# EAGLE schematic SCHEMAT_PŁYTY_GŁÓWNEJ (EAGLE 9.2.0)
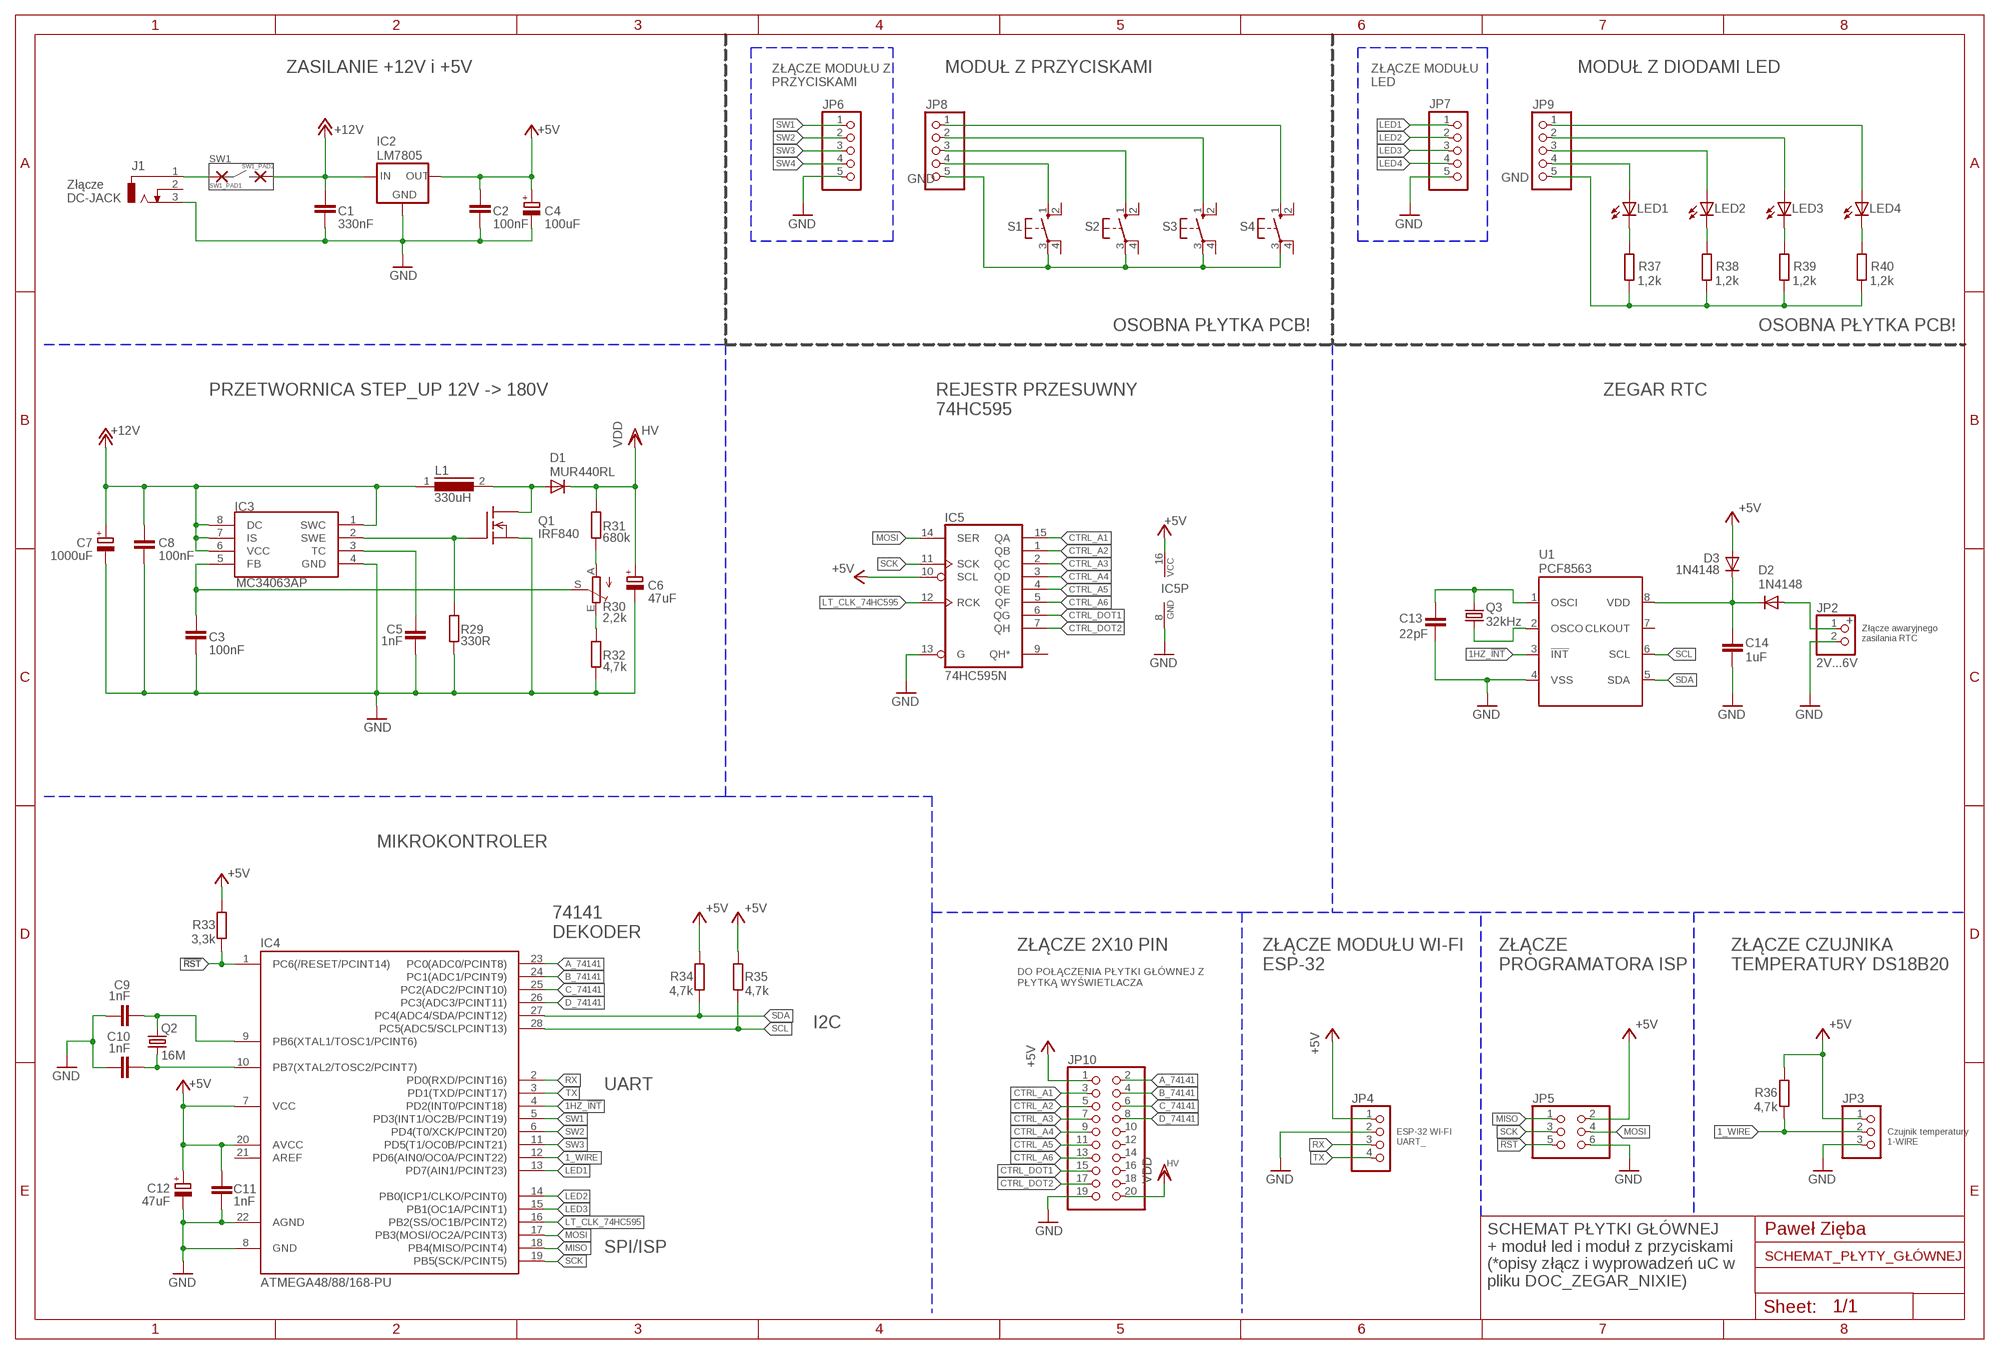
[diagram p0: schematic, sheet 1]

## Parts
C1  330nF  C-EU050-045X075  [C050-045X075]
C2  100nF  C-EU050-045X075  [C050-045X075]
C3  100nF  C-EU050-045X075  [C050-045X075]
C4  100uF  CPOL-EUE5-13  [E5-13]
C5  1nF  C-EU050-045X075  [C050-045X075]
C6  47uF  CPOL-EUE5-13  [E5-13]
C7  1000uF  CPOL-EUE5-13  [E5-13]
C8  100nF  C-EU050-045X075  [C050-045X075]
C9  1nF  C-EU050-045X075  [C050-045X075]
C10  1nF  C-EU050-045X075  [C050-045X075]
C11  1nF  C-EU050-045X075  [C050-045X075]
C12  47uF  CPOL-EUE5-13  [E5-13]
C13  22pF  C-EU050-045X075  [C050-045X075]
C14  1uF  C-EU050-045X075  [C050-045X075]
D1  MUR440RL  [C2673]
D2  1N4148  1N4148DO35-10  [DO35-10]
D3  1N4148  1N4148DO35-10  [DO35-10]
IC2  LM7805  78XXS  [78XXS]
IC3  MC34063AP  [DIL08]
IC4  ATMEGA48/88/168-PU  [DIL28-3]
IC5  74HC595N  [DIL16]
J1  DCJ0303  [DCJ0303]
JP2  2V...6V  PINHD-1X2  [1X02]
JP3  PINHD-1X3  [1X03]
JP4  PINHD-1X4  [1X04]
JP5  PINHD-2X3  [2X03]
JP6  PINHD-1X5  [1X05]
JP7  PINHD-1X5  [1X05]
JP8  PINHD-1X5  [1X05]
JP9  PINHD-1X5  [1X05]
JP10  PINHD-2X10  [2X10]
L1  330uH  SFT830S  [SFT830S]
LED1  LED5MM  [LED5MM]
LED2  LED5MM  [LED5MM]
LED3  LED5MM  [LED5MM]
LED4  LED5MM  [LED5MM]
Q1  IRF840  [TO220]
Q2  16M  CRYSTALHC49U-V  [HC49U-V]
Q3  32kHz  CRYSTALTC26H  [TC26H]
R29  330R  R-EU7  [204/7]
R30  2,2k  TRIM_EU-CA6V  [CA6V]
R31  680k  R-EU7  [204/7]
R32  4,7k  R-EU7  [204/7]
R33  3,3k  R-EU7  [204/7]
R34  4,7k  R-EU7  [204/7]
R35  4,7k  R-EU7  [204/7]
R36  4,7k  R-EU7  [204/7]
R37  1,2k  R-EU7  [204/7]
R38  1,2k  R-EU7  [204/7]
R39  1,2k  R-EU7  [204/7]
R40  1,2k  R-EU7  [204/7]
S1  10-XX  [B3F-10XX]
S2  10-XX  [B3F-10XX]
S3  10-XX  [B3F-10XX]
S4  10-XX  [B3F-10XX]
SW1_PAD1  3,81/1,4  [3,81/1,4]
SW1_PAD2  3,81/1,4  [3,81/1,4]
U1  PCF8563  [DIL08]

## Nets
1_WIRE: IC4.12(PD6(AIN0/OC0A/PCINT22)) JP3.2 R36.P$1
1HZ_!INT: IC4.4(PD2(INT0/PCINT18)) U1.3(!INT)
!RST: IC4.1(PC6(/RESET/PCINT14)) JP5.5 R33.P$1
+5V: C2.1 C4.+ C11.2 C12.+ D3.A IC2.OUT IC4.7(VCC) IC4.20(AVCC) IC5.10(SCL) IC5.16(VCC) JP3.1 JP4.1 JP5.2 JP10.1 R33.P$2 R34.P$2 R35.P$2 R36.P$2
+12V: C1.1 C7.+ C8.1 IC2.IN IC3.1(SWC) IC3.6(VCC) IC3.7(IS) IC3.8(DC) L1.1 SW1_PAD2.1(P)
A_74141: IC4.23(PC0(ADC0/PCINT8)) JP10.2
B_74141: IC4.24(PC1(ADC1/PCINT9)) JP10.4
C_74141: IC4.25(PC2(ADC2/PCINT10)) JP10.6
CTRL_A1: IC5.15(QA) JP10.3
CTRL_A2: IC5.1(QB) JP10.5
CTRL_A3: IC5.2(QC) JP10.7
CTRL_A4: IC5.3(QD) JP10.9
CTRL_A5: IC5.4(QE) JP10.11
CTRL_A6: IC5.5(QF) JP10.13
CTRL_DOT1: IC5.6(QG) JP10.15
CTRL_DOT2: IC5.7(QH) JP10.17
D_74141: IC4.26(PC3(ADC3/PCINT11)) JP10.8
GND: C1.2 C2.2 C3.2 C4.- C5.2 C6.- C7.- C8.2 C9.1 C10.1 C11.1 C12.- C13.2 C14.2 IC2.GND IC3.4(GND) IC4.8(GND) IC4.22(AGND) IC5.8(GND) IC5.13(G) J1.3 JP2.2 JP3.3 JP4.2 JP5.6 JP6.5 JP7.5 JP10.19 Q1.3(S) R29.P$1 R32.P$1 U1.4(VSS)
HV: C6.+ D1.C JP10.20 R31.P$2 ; supply symbol labelled VDD
LED1: IC4.13(PD7(AIN1/PCINT23)) JP7.1
LED2: IC4.14(PB0(ICP1/CLKO/PCINT0)) JP7.2
LED3: IC4.15(PB1(OC1A/PCINT1)) JP7.3
LED4: JP7.4
LT_CLK_74HC595: IC4.16(PB2(SS/OC1B/PCINT2)) IC5.12(RCK)
MISO: IC4.18(PB4(MISO/PCINT4)) JP5.1
MOSI: IC4.17(PB3(MOSI/OC2A/PCINT3)) IC5.14(SER) JP5.4
N$21: J1.1 SW1_PAD1.1(P)
N$22: C5.1 IC3.3(TC)
N$23: R30.A R31.P$1
N$24: C9.2 IC4.9(PB6(XTAL1/TOSC1/PCINT6)) Q2.1
N$25: C10.2 IC4.10(PB7(XTAL2/TOSC2/PCINT7)) Q2.2
N$26: R30.E R32.P$2
N$27: JP9.4 LED1.A
N$28: IC3.2(SWE) Q1.1(G) R29.P$2
N$29: D1.A L1.2 Q1.2(D)
N$30: C3.1 IC3.5(FB) R30.S
N$31: Q3.1 U1.2(OSCO)
N$32: C13.1 Q3.2 U1.1(OSCI)
N$33: C14.1 D2.C D3.C U1.8(VDD)
N$34: D2.A JP2.1
N$35: JP9.3 LED2.A
N$36: JP9.2 LED3.A
N$37: JP9.1 LED4.A
N$38: JP9.5 R37.P$1 R38.P$1 R39.P$1 R40.P$1
N$39: LED1.K(C) R37.P$2
N$40: LED2.K(C) R38.P$2
N$41: LED3.K(C) R39.P$2
N$42: LED4.K(C) R40.P$2
N$43: JP8.1 S4.1(S)
N$44: JP8.2 S3.1(S)
N$45: JP8.3 S2.1(S)
N$46: JP8.4 S1.1(S)
N$47: JP8.5 S1.3(P) S2.3(P) S3.3(P) S4.3(P)
RX: IC4.2(PD0(RXD/PCINT16)) JP4.3
SCK: IC4.19(PB5(SCK/PCINT5)) IC5.11(SCK) JP5.3
SCL: IC4.28(PC5(ADC5/SCLPCINT13)) R35.P$1 U1.6(SCL)
SDA: IC4.27(PC4(ADC4/SDA/PCINT12)) R34.P$1 U1.5(SDA)
SW1: IC4.5(PD3(INT1/OC2B/PCINT19)) JP6.1
SW2: IC4.6(PD4(T0/XCK/PCINT20)) JP6.2
SW3: IC4.11(PD5(T1/OC0B/PCINT21)) JP6.3
SW4: JP6.4
TX: IC4.3(PD1(TXD/PCINT17)) JP4.4
Unconnected: IC4.21(AREF) IC5.9(QH*) J1.2 JP10.10 JP10.12 JP10.14 JP10.16 JP10.18 S1.2(S1) S1.4(P1) S2.2(S1) S2.4(P1) S3.2(S1) S3.4(P1) S4.2(S1) S4.4(P1) U1.7(CLKOUT)

## Notes on the sheet
- ZASILANIE +12V i +5V | MODUŁ Z PRZYCISKAMI | MODUŁ Z DIODAMI LED
- ZŁĄCZE MODUŁU Z
  PRZYCISKAMI
- ZŁĄCZE MODUŁU 
  LED
- SW1
- GND | GND
- Złącze
  DC-JACK
- OSOBNA PŁYTKA PCB! | OSOBNA PŁYTKA PCB!
- PRZETWORNICA STEP_UP 12V -> 180V | ZEGAR RTC
- REJESTR PRZESUWNY
  74HC595
- +
- Złącze awaryjnego
  zasilania RTC
- MIKROKONTROLER
- 74141
  DEKODER
- ZŁĄCZE 2X10 PIN
- ZŁĄCZE MODUŁU WI-FI
  ESP-32
- ZŁĄCZE 
  PROGRAMATORA ISP
- ZŁĄCZE CZUJNIKA 
  TEMPERATURY DS18B20
- DO POŁĄCZENIA PŁYTKI GŁÓWNEJ Z
  PŁYTKĄ WYŚWIETLACZA
- I2C
- UART
- ESP-32 WI-FI
  UART_
- Czujnik temperatury
  1-WIRE
- Paweł Zięba
- SPI/ISP
- SCHEMAT PŁYTKI GŁÓWNEJ 
  + moduł led i moduł z przyciskami
  (*opisy złącz i wyprowadzeń uC w
  pliku DOC_ZEGAR_NIXIE)

## Library data of the parts
C1-C3 C5 C8-C11 C13 C14 = rcl:C-EU: CAPACITOR, European symbol; SPICEPREFIX: C
C4 C6 C7 C12 = rcl:CPOL-EU: POLARIZED CAPACITOR, European symbol; SPICEPREFIX: C
D1 = diode:MUR440RL: DIODE ultra-fast recovery rectifier, Vrrm = 40 V, 4 A
D2 D3 = diode:1N4148: DIODE high speed (Philips)
IC2 = v-reg:78XXS: VOLTAGE REGULATOR
IC3 = mc34063:MC34063; SPICEPREFIX: X
IC4 = atmega8+:ATMEGA48/88/168-PU
IC5 = 74xx-eu:74*595: 8-bit SHIFT REGISTER, output latch
J1 = con-jack:DCJ0303: DC POWER JACK Source: DCJ0303.pdf; OC_FARNELL: unknown; OC_NEWARK: unknown
JP2 = pinhead:PINHD-1X2: PIN HEADER
JP3 = pinhead:PINHD-1X3: PIN HEADER
JP4 = pinhead:PINHD-1X4: PIN HEADER
JP5 = pinhead:PINHD-2X3: PIN HEADER
JP6-JP9 = pinhead:PINHD-1X5: PIN HEADER
JP10 = pinhead:PINHD-2X10: PIN HEADER
L1 = inductors:SFT830S: INDUCTOR; SPICEPREFIX: L
LED1-LED4 = led:LED: LED OSRAM: - CHIPLED LG R971, LG N971, LY N971, LG Q971, LY Q971, LO R971, LY R971 LH N974, LH R974 LS Q976, LO Q976, LY Q976 LO Q996 - Hyper CHIPLED LW Q18S LB Q993, LB Q99A, LB R99A - SideLED LS A670, LO A670, LY A670, LG A670, LP A670 LB A673, LV A673, LT A673, LW A673 LH A674 LY A675 LS A676, LA A676, LO A676, LY A676, LW A676 LS A679, LY A679, LG A679 - Hyper Micro SIDELED® LS Y876, LA Y876, LO Y876, LY Y876 LT Y87S - SmartLED LW L88C, LW L88S LB L89C, LB L89S, LG L890 LS L89K, LO L89K, LY L89K LS L896, LA L896, LO L896, LY L896 - TOPLED LS T670, LO T670, LY T670, LG T670, LP T670 LSG T670, LSP T670, LSY T670, LOP T670, LYG T670 LG T671, LOG T671, LSG T671 LB T673, LV T673, LT T673, LW T673 LH T674 LS T676, LA T676, LO T676, LY T676, LB T676, LH T676, LSB T676, LW T676 LB T67C, LV T67C, LT T67C, LS T67K, LO T67K, LY T67K, LW E67C LS E67B, LA E67B, LO E67B, LY E67B, LB E67C, LV E67C, LT E67C LW T67C LS T679, LY T679, LG T679 LS T770, LO T770, LY T770, LG T770, LP T770 LB T773, LV T773, LT T773, LW T773 LH T774 LS E675, LA E675, LY E675, LS T675 LS T776, LA T776, LO T776, LY T776, LB T776 LHGB T686 LT T68C, LB T68C - Hyper Mini TOPLED® LB M676 - Mini TOPLED Santana® LG M470 LS M47K, LO M47K, LY M47K Source: http://www.osram.convergy.de LUXEON: - LUMILED® LXK2-PW12-R00, LXK2-PW12-S00, LXK2-PW14-U00, LXK2-PW14-V00 LXK2-PM12-R00, LXK2-PM12-S00, LXK2-PM14-U00 LXK2-PE12-Q00, LXK2-PE12-R00, LXK2-PE12-S00, LXK2-PE14-T00, LXK2-PE14-U00 LXK2-PB12-K00, LXK2-PB12-L00, LXK2-PB12-M00, LXK2-PB14-N00, LXK2-PB14-P00, LXK2-PB14-Q00 LXK2-PR12-L00, LXK2-PR12-M00, LXK2-PR14-Q00, LXK2-PR14-R00 LXK2-PD12-Q00, LXK2-PD12-R00, LXK2-PD12-S00 LXK2-PH12-R00, LXK2-PH12-S00 LXK2-PL12-P00, LXK2-PL12-Q00, LXK2-PL12-R00 Source: www.luxeon.com KINGBRIGHT: KA-3528ASYC Source: www.kingbright.com
Q1 = transistor-fet:IRF840: N-Channel Enhancement MOSFET (HEXFET); 500V; 8A; 0,85Ohm
Q2 = crystal:CRYSTAL: CRYSTAL; OC_FARNELL: 1666969; OC_NEWARK: unknown
Q3 = crystal:CRYSTAL: CRYSTAL; OC_FARNELL: unknown; OC_NEWARK: unknown
R29 R31-R40 = RCL!:R-EU
R30 = pot:TRIM_EU-: POTENTIOMETER
S1-S4 = switch-omron:10-XX: OMRON SWITCH; MPN: B3F-1000; OC_FARNELL: 176432; OC_NEWARK: 36M3542
SW1_PAD1 SW1_PAD2 = wirepad:3,81/1,4: THROUGH-HOLE PAD
U1 = Układy_scalone:PCF8563